# Altium schematic sheet BusSelect.SchDoc
size A
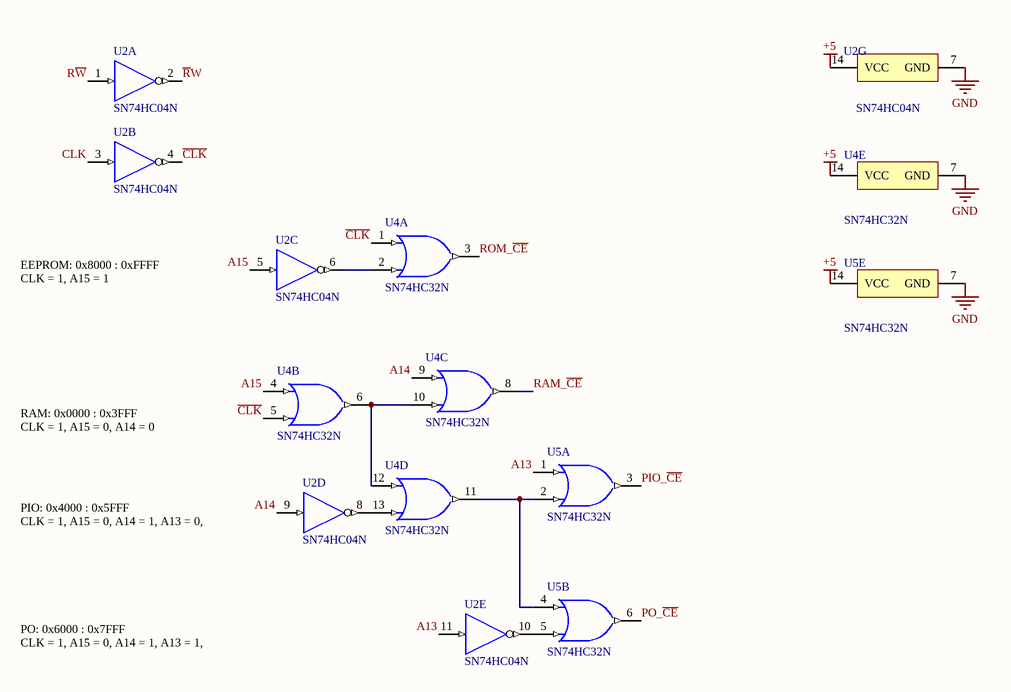
[diagram p0: BusSelect.SchDoc]

## Parts
U2  SN74HC04N  [N0014A]  (parts A,B,C,D,E,G of 7)
U4  SN74HC32N  [N0014A]  (parts A,B,C,D,E of 5)
U5  SN74HC32N  [N0014A]  (parts A,B,E of 5)

## Nets
+5: U2.14(VCC) U4.14(VCC) U5.14(VCC)
GND: U2.7(GND) U4.7(GND) U5.7(GND)
A13: U2.11(5A) U5.1(1A)
A14: U2.9(4A) U4.9(3A)
A15: U2.5(3A) U4.4(2A)
~{CLK}: U2.4(~{2Y}) U4.1(1A) U4.5(2B)
CLK: U2.3(2A)
PIO_~{CE}: U5.3(1Y)
PO_~{CE}: U5.6(2Y)
~{R}W: U2.2(~{1Y})
RAM_~{CE}: U4.8(3Y)
ROM_~{CE}: U4.3(1Y)
R~{W}: U2.1(1A)
NetU2_6: U2.6(~{3Y}) U4.2(1B)
NetU2_8: U2.8(~{4Y}) U4.13(4B)
NetU2_10: U2.10(~{5Y}) U5.5(2B)
NetU4_6: U4.6(2Y) U4.10(3B) U4.12(4A)
NetU4_11: U4.11(4Y) U5.2(1B) U5.4(2A)

## Notes on the sheet
- EEPROM: 0x8000 : 0xFFFF
  CLK = 1, A15 = 1
- RAM: 0x0000 : 0x3FFF
  CLK = 1, A15 = 0, A14 = 0
- PIO: 0x4000 : 0x5FFF
  CLK = 1, A15 = 0, A14 = 1, A13 = 0,
- PO: 0x6000 : 0x7FFF
  CLK = 1, A15 = 0, A14 = 1, A13 = 1,

## Library data of the parts
U2 = CMP-1615-00892-2: Hex Inverters, N0014A, TUBE; Manufacturer: Texas Instruments; VCC(Min)(V): 2; Bits(#): 6; Technology Family: HC; tpd @ Nom Voltage(Max)(ns): 20; Output Drive (IOL/IOH)(Max)(mA): -4/4; Rating: Catalog; Voltage(Nom)(V): 5; Schmitt Trigger: No; ICC @ Nom Voltage(Max)(mA): 0.02; Input Type: CMOS; Code_JEDEC: MS-001; PackageReference: N0014A; DatasheetVersion: SCLS078F; Output Type: CMOS; VCC(Max)(V): 6; Operating Temperature Range(C): -40 to 85; Generic Part Number: SN74HC04; F @ Nom Voltage(Max)(Mhz): 20
U4 U5 = CMP-1573-00148-3: Quadruple 2-Input Positive-OR Gates, N0014A, TUBE; Manufacturer: Texas Instruments; Output Type: CMOS; Rating: Catalog; ICC @ Nom Voltage(Max)(mA): 0.02; VCC(Min)(V): 2; VCC(Max)(V): 6; Bits(#): 4; tpd @ Nom Voltage(Max)(ns): 25; Voltage(Nom)(V): 5; F @ Nom Voltage(Max)(Mhz): 70; Output Drive (IOL/IOH)(Max)(mA): 5.2/-5.2; PackageVersion: http://www.ti.com/lit/ml/mpdi002c/mpdi002c.pdf; Operating Temperature Range(C): -40 to 85; Code_JEDEC: MS-001; DatasheetVersion: SCLS200D; Generic Part Number: SN74HC32; Input Type: CMOS; PackageReference: N0014A